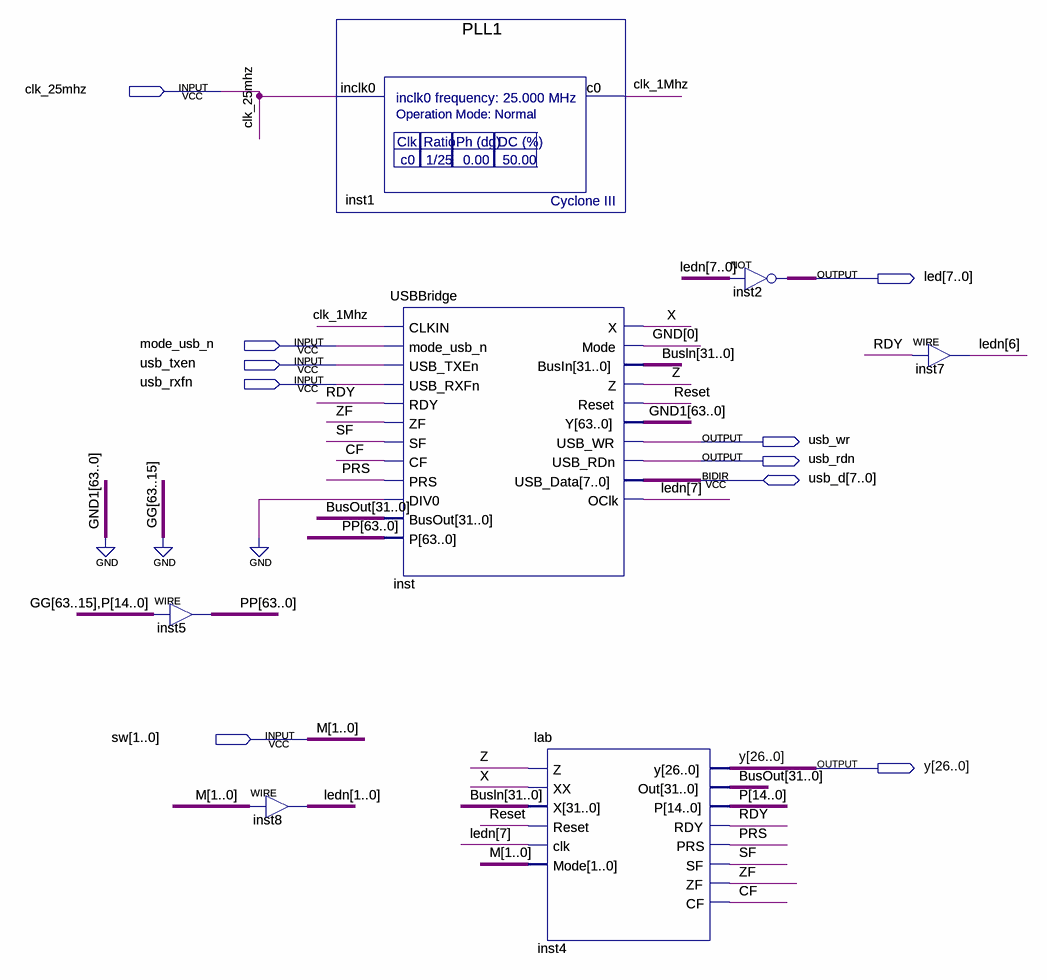
[diagram p0: schematic sheet]
// Quartus schematic lab1.bdf as structural Verilog: 14 symbols, 19 pins
module lab1 (
  input  clk_25mhz,
  input  mode_usb_n,
  input  usb_txen,
  input  usb_rxfn,
  input  [1:0] sw,
  inout  [7:0] usb_d,
  output [7:0] led,
  output usb_wr,
  output usb_rdn,
  output [26:0] y
);

  wire CF, clk_1Mhz, PRS, RDY, Reset, SF, X, Z, ZF;
  wire [0:0] GND;
  wire [7:0] ledn;
  wire [14:0] P;
  wire [31:0] Busln, BusOut;
  wire [63:0] GND1, PP;

  assign PP = {{49{1'b0}}, P};  // WIRE inst5
  assign PP = {{49{1'b0}}, P};  // WIRE inst5
  assign ledn[1:0] = sw;  // WIRE inst8
  assign ledn[1:0] = sw;  // WIRE inst8
  PLL1 inst1 (.inclk0(clk_25mhz), .c0(clk_1Mhz));
  PLL1 inst1_dup2 (.inclk0(clk_25mhz), .c0(clk_1Mhz));
  USBBridge inst (
    .CLKIN(clk_1Mhz), .mode_usb_n(mode_usb_n), .USB_TXEn(usb_txen), .USB_RXFn(usb_rxfn), .RDY(RDY), .ZF(ZF),
    .SF(SF), .CF(CF), .PRS(PRS), .DIV0(1'b0), .BusOut(BusOut), .P(PP), .X(X), .Mode(GND[0]), .BusIn(Busln),
    .Z(Z), .Reset(Reset), .Y(GND1), .USB_WR(usb_wr), .USB_RDn(usb_rdn), .OClk(ledn[7]), .USB_Data(usb_d));
  USBBridge inst_dup2 (
    .CLKIN(clk_1Mhz), .mode_usb_n(mode_usb_n), .USB_TXEn(usb_txen), .USB_RXFn(usb_rxfn), .RDY(RDY), .ZF(ZF),
    .SF(SF), .CF(CF), .PRS(PRS), .DIV0(1'b0), .BusOut(BusOut), .P(PP), .X(X), .Mode(GND[0]), .BusIn(Busln),
    .Z(Z), .Reset(Reset), .Y(GND1), .USB_WR(usb_wr), .USB_RDn(usb_rdn), .OClk(ledn[7]), .USB_Data(usb_d));
  lab inst4 (
    .Z(Z), .XX(X), .X(Busln), .Reset(Reset), .clk(ledn[7]), .Mode(sw), .y(y), .Out(BusOut), .P(P), .RDY(RDY),
    .PRS(PRS), .SF(SF), .ZF(ZF), .CF(CF));
  lab inst4_dup2 (
    .Z(Z), .XX(X), .X(Busln), .Reset(Reset), .clk(ledn[7]), .Mode(sw), .y(y), .Out(BusOut), .P(P), .RDY(RDY),
    .PRS(PRS), .SF(SF), .ZF(ZF), .CF(CF));
  assign led = ~ledn;  // NOT inst2, 8 bits wide
  assign led = ~ledn;  // NOT inst2, 8 bits wide
  assign ledn[6] = RDY;  // WIRE inst7
  assign ledn[6] = RDY;  // WIRE inst7
  // also tied to GND on the sheet: {GND1[0], GND1[1], GND1[2], GND1[3], GND1[4], GND1[5], GND1[6], GND1[7], GND1[8], GND1[9], GND1[10], GND1[11], GND1[12], GND1[13], GND1[14], GND1[15], GND1[16], GND1[17], GND1[18], GND1[19], GND1[20], GND1[21], GND1[22], GND1[23], GND1[24], GND1[25], GND1[26], GND1[27], GND1[28], GND1[29], GND1[30], GND1[31], GND1[32], GND1[33], GND1[34], GND1[35], GND1[36], GND1[37], GND1[38], GND1[39], GND1[40], GND1[41], GND1[42], GND1[43], GND1[44], GND1[45], GND1[46], GND1[47], GND1[48], GND1[49], GND1[50], GND1[51], GND1[52], GND1[53], GND1[54], GND1[55], GND1[56], GND1[57], GND1[58], GND1[59], GND1[60], GND1[61], GND1[62], GND1[63]}

  // Other names for the same wires on the sheet: M[1:0] = sw
endmodule
